# Altium schematic sheet Power Supplies.SchDoc
size A4
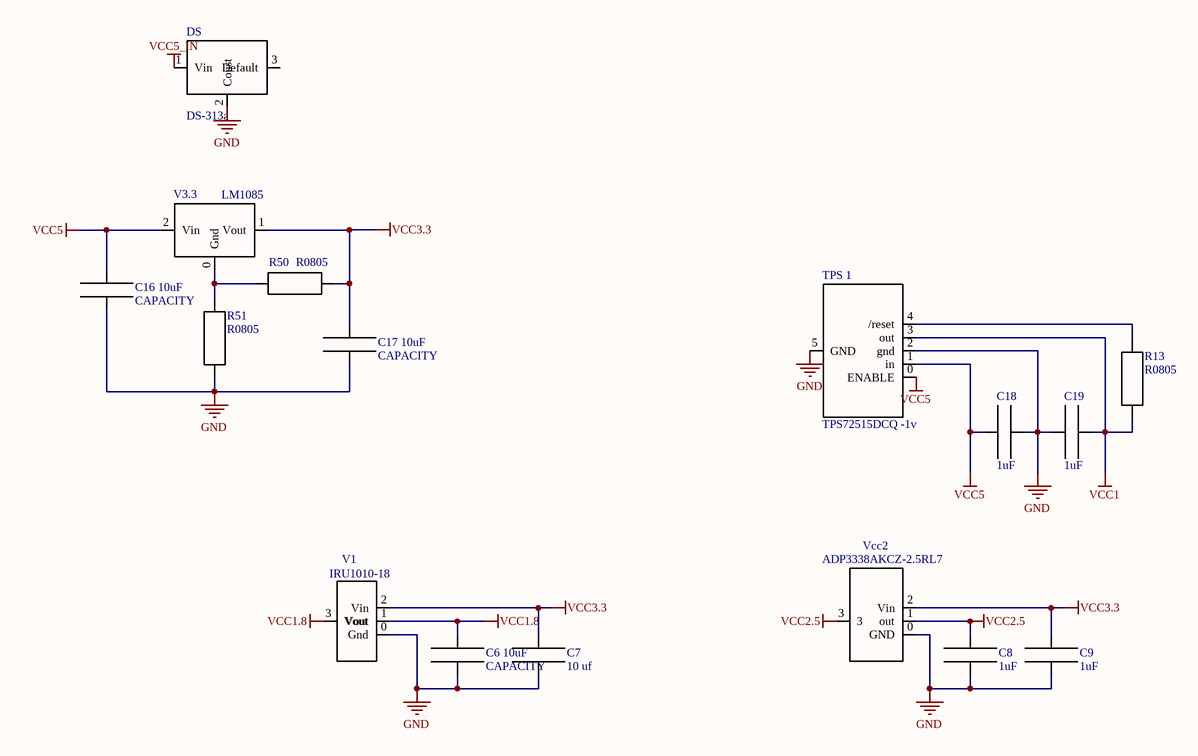
[diagram p0: Power Supplies.SchDoc]

## Parts
C6_10uF  CAPACITY  [1206]
C7  10 uf  [1206]
C8  1uF  [1206]
C9  1uF  [1206]
C16_10uF  CAPACITY  [1206]
C17_10uF  CAPACITY  [1206]
C18  1uF  [1206]
C19  1uF  [1206]
DS  DS-313a  [ds-313]
R13  R0805  [R0805]
R50  R0805  [R0805]
R51  R0805  [R0805]
TPS_1  TPS72515DCQ -1v  [SOT223-5]
V1  IRU1010-18  [IRU1010-18]
V3.3  LM1085  [LM1085]
Vcc2  ADP3338AKCZ-2.5RL7  [sot223]

## Nets
GND: C6_10uF.2 C7.2 C8.2 C9.2 C16_10uF.2 C17_10uF.2 C18.2 C19.1 DS.2(Const) R51.1 TPS_1.2(gnd) TPS_1.5(GND) V1.0(Gnd) Vcc2.0(GND)
VCC1: C19.2 R13.1 TPS_1.3(out)
VCC1.8: C6_10uF.1 V1.1(Vout) V1.3(Vout)
VCC2.5: C8.1 Vcc2.1(out) Vcc2.3
VCC3.3: C7.1 C9.1 C17_10uF.1 R50.2 V1.2(Vin) V3.3.1(Vout) Vcc2.2(Vin)
VCC5: C16_10uF.1 C18.1 TPS_1.0(ENABLE) TPS_1.1(in) V3.3.2(Vin)
VCC5_IN: DS.1(Vin)
NetR13_2: R13.2 TPS_1.4(/reset)
NetR50_1: R50.1 R51.2 V3.3.0(Gnd)

Not connected (* = marked no-connect by the designer): DS 3(Default)

## Library data of the parts
C7-C9 C18 C19 = CAPACITY